# EAGLE schematic dmx-transciever (EAGLE 7.5.0)
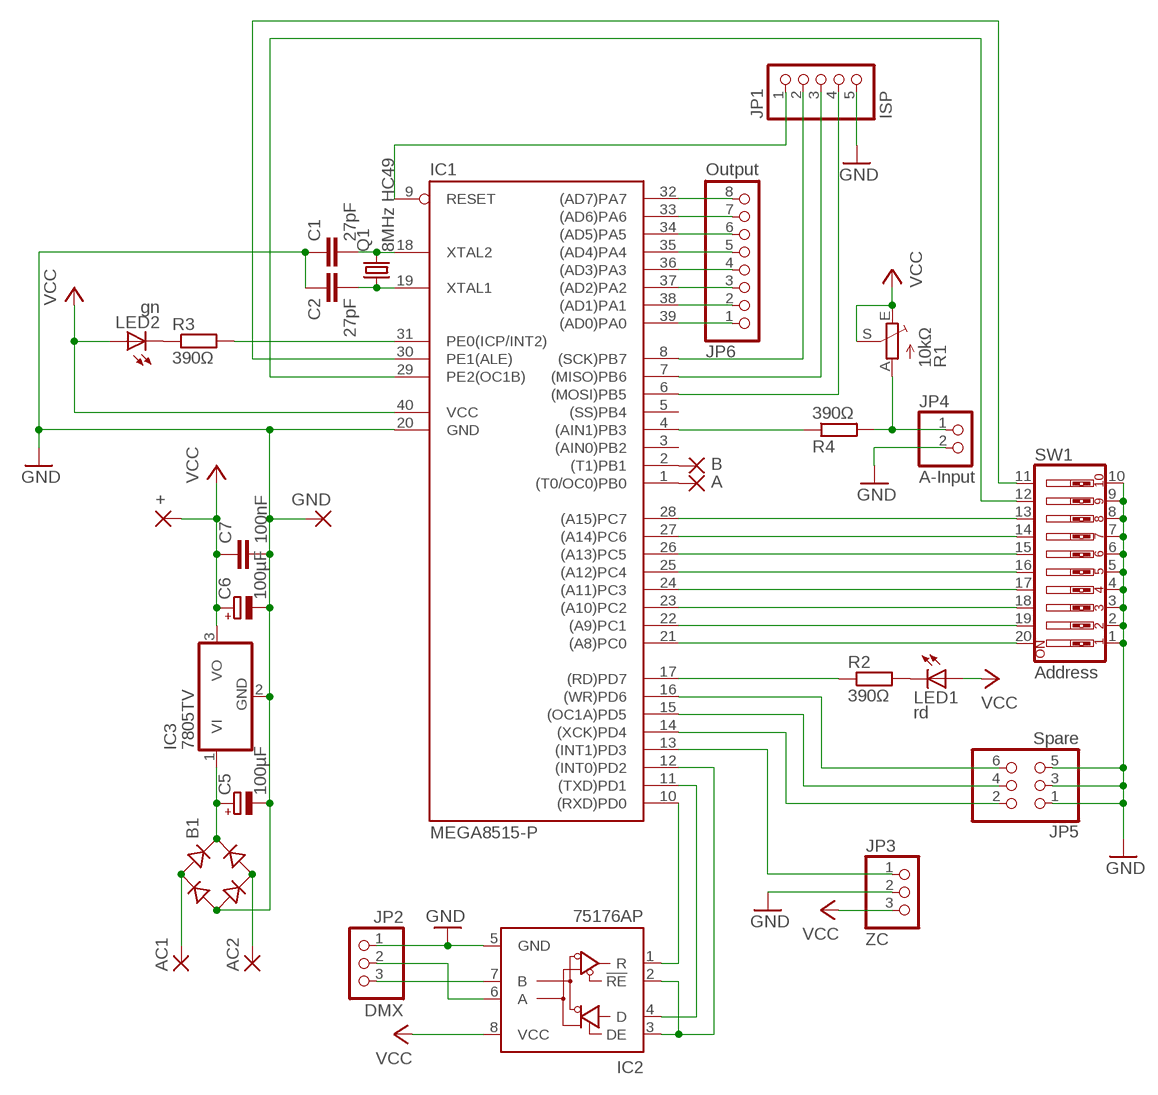
[diagram p0: schematic, sheet 1]

## Parts
+  WIREPAD2,54/1,0  [2,54/1,0]
A  WIREPAD2,54/1,0  [2,54/1,0]
AC1  WIREPAD2,54/1,0  [2,54/1,0]
AC2  WIREPAD2,54/1,0  [2,54/1,0]
B  WIREPAD2,54/1,0  [2,54/1,0]
B1  RB1A  [RB1A]
C1  27pF  C-EU050-024X044  [C050-024X044]
C2  27pF  C-EU050-024X044  [C050-024X044]
C5  100µF  CPOL-EUE2.5-7  [E2,5-7]
C6  100µF  CPOL-EUE2.5-7  [E2,5-7]
C7  100nF  C-EU050-024X044  [C050-024X044]
GND  WIREPAD2,54/1,0  [2,54/1,0]
IC1  MEGA8515-P  [DIL40]
IC2  75176AP  [DIL08]
IC3  7805TV  [TO220V]
JP1  ISP  PINHD-1X5  [1X05]
JP2  DMX  PINHD-1X3  [1X03]
JP3  ZC  PINHD-1X3  [1X03]
JP4  A-Input  PINHD-1X2  [1X02]
JP5  Spare  PINHD-2X3  [2X03]
JP6  Output  PINHD-1X8  [1X08]
LED1  rd  TLLR4400  [LED3MM]
LED2  gn  TLLG4400  [LED3MM]
Q1  8MHz HC49  CRYSTALHC49S  [HC49/S]
R1  10kΩ  TRIM_EU-PT10S  [PT-10S]
R2  390Ω  R-EU_0207/10  [0207/10]
R3  390Ω  R-EU_0309/V  [0309V]
R4  390Ω  R-EU_0207/10  [0207/10]
SW1  Address  SW_DIP-10  [EDG-10]

## Nets
GND: B1.- C1.1 C2.1 C5.- C6.- C7.2 GND.1(P) IC1.20(GND) IC2.5(GND) IC3.2(GND) JP1.5 JP2.1 JP3.2 JP4.2 JP5.1 JP5.3 JP5.5 SW1.1 SW1.2 SW1.3 SW1.4 SW1.5 SW1.6 SW1.7 SW1.8 SW1.9 SW1.10
N$1: IC1.39((AD0)PA0) JP6.1
N$2: IC1.38((AD1)PA1) JP6.2
N$3: IC1.37((AD2)PA2) JP6.3
N$4: IC1.36((AD3)PA3) JP6.4
N$5: IC1.35((AD4)PA4) JP6.5
N$6: IC1.34((AD5)PA5) JP6.6
N$7: IC1.33((AD6)PA6) JP6.7
N$8: IC1.32((AD7)PA7) JP6.8
N$9: JP4.1 R1.A R4.2
N$10: LED2.K(C) R3.1
N$11: IC1.8((SCK)PB7) JP1.2
N$12: IC1.7((MISO)PB6) JP1.3
N$13: IC1.6((MOSI)PB5) JP1.4
N$14: IC1.4((AIN1)PB3) R4.1
N$15: IC1.17((RD)PD7) R2.1
N$16: IC1.28((A15)PC7) SW1.13
N$17: IC1.27((A14)PC6) SW1.14
N$18: IC1.26((A13)PC5) SW1.15
N$19: IC1.25((A12)PC4) SW1.16
N$20: IC1.24((A11)PC3) SW1.17
N$21: IC1.23((A10)PC2) SW1.18
N$22: IC1.22((A9)PC1) SW1.19
N$23: IC1.21((A8)PC0) SW1.20
N$24: IC1.16((WR)PD6) JP5.6
N$25: IC1.15((OC1A)PD5) JP5.4
N$26: IC1.14((XCK)PD4) JP5.2
N$27: IC1.13((INT1)PD3) JP3.1
N$28: IC1.10((RXD)PD0) IC2.1(R)
N$29: IC1.12((INT0)PD2) IC2.2(!RE) IC2.3(DE)
N$30: IC1.9(RESET) JP1.1
N$31: IC1.11((TXD)PD1) IC2.4(D)
N$32: C1.2 IC1.18(XTAL2) Q1.2
N$33: IC2.6(A) JP2.2
N$34: IC2.7(B) JP2.3
N$35: C2.2 IC1.19(XTAL1) Q1.1
N$36: B1.+ C5.+ IC3.1(VI)
N$37: IC1.31(PE0(ICP/INT2)) R3.2
N$38: LED1.K(C) R2.2
N$39: IC1.29(PE2(OC1B)) SW1.12
N$40: IC1.30(PE1(ALE)) SW1.11
N$41: A.1(P) IC1.1((T0/OC0)PB0)
N$42: AC2.1(P) B1.AC2
N$43: AC1.1(P) B1.AC1
N$44: B.1(P) IC1.2((T1)PB1)
VCC: +.1(P) C6.+ C7.1 IC1.40(VCC) IC2.8(VCC) IC3.3(VO) JP3.3 LED1.A LED2.A R1.E R1.S
Unconnected: IC1.3((AIN0)PB2) IC1.5((SS)PB4)

## Library data of the parts
+ A AC1 AC2 B GND = wirepad:WIREPAD: Wire PAD connect wire on PCB
B1 = rectifier:RB1A: RECTIFIER 1 A
C1 C2 C7 = rcl:C-EU: CAPACITOR, European symbol
C5 C6 = rcl:CPOL-EU: POLARIZED CAPACITOR, European symbol
IC1 = avr-7:MEGA8515-P: MICROCONTROLLER 8 Kbytes FLASH 512 bytes SRAM 512 bytes EEPROM USART 8-channel 10 bit ADC
IC2 = 751xx:75176A: DIFFERENTIAL BUS TRANSCEIVER Source: http://focus.ti.com/lit/ds/symlink/sn75176a.pdf
IC3 = linear:78*: Positive VOLTAGE REGULATOR Source: http://cache.national.com/ds/LM/LM78L05.pdf http://www.fairchildsemi.com/ds/LM/LM7805.pdf
JP1 = pinhead:PINHD-1X5: PIN HEADER
JP2 JP3 = pinhead:PINHD-1X3: PIN HEADER
JP4 = pinhead:PINHD-1X2: PIN HEADER
JP5 = pinhead:PINHD-2X3: PIN HEADER
JP6 = pinhead:PINHD-1X8: PIN HEADER
LED1 = led:TLLR4400: Low Current (2mA) LED 3 mm Tinted Diffused Package color RED Source: Data sheet <http://www.farnell.com/datasheets/391100.pdf>; MF: VISHAY SEMICONDUCTOR; OC_FARNELL: 1612437
LED2 = led:TLLG4400: Low Current (2mA) LED 3 mm Tinted Diffused Package color GREEN Source: Data sheet <http://www.farnell.com/datasheets/391098.pdf>; MF: VISHAY SEMICONDUCTOR; OC_FARNELL: 1612435
Q1 = crystal:CRYSTAL: CRYSTAL; OC_FARNELL: 1667008; OC_NEWARK: unknown
R1 = pot:TRIM_EU-: POTENTIOMETER
R2-R4 = resistor:R-EU_: RESISTOR, European symbol
SW1 = special:SW_DIP-10: DIP SWITCH